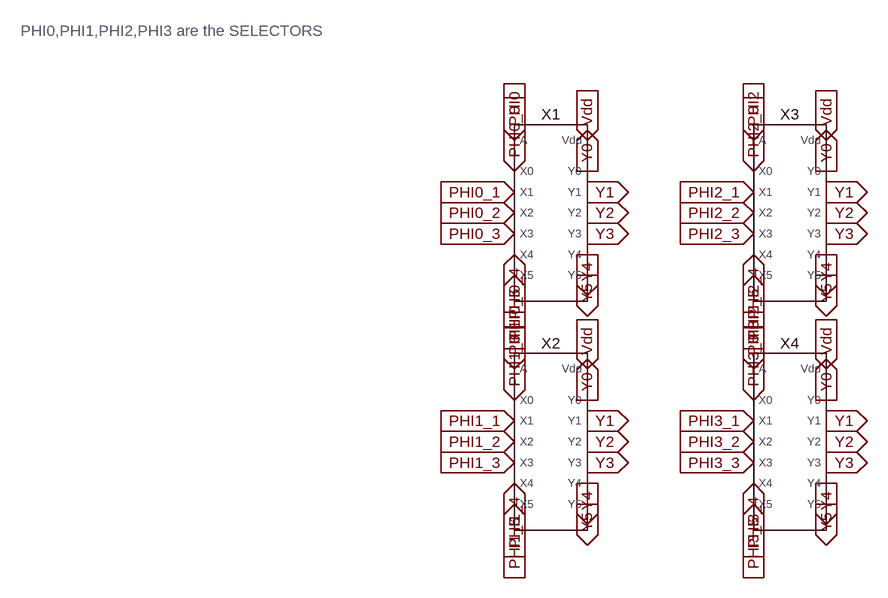
[diagram p0: schematic 24X6MUC.asc]
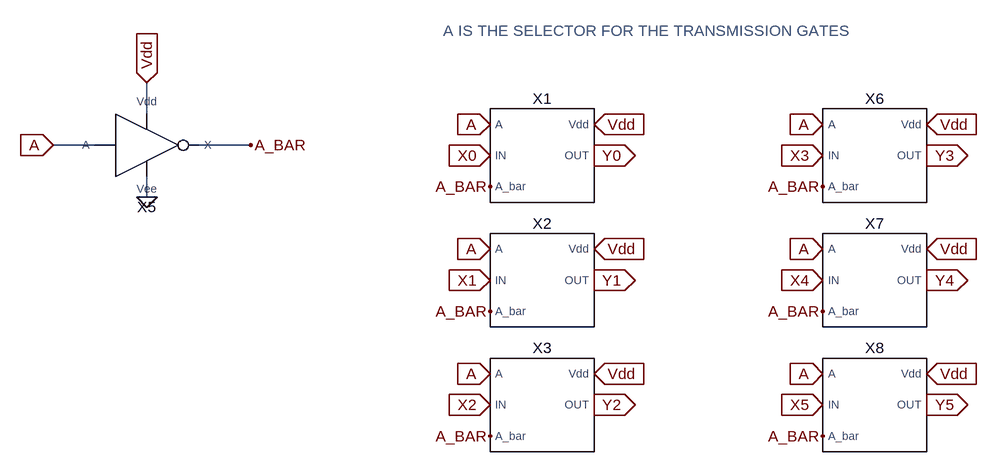
[diagram p1: sub-circuit 6x6tg.asc]
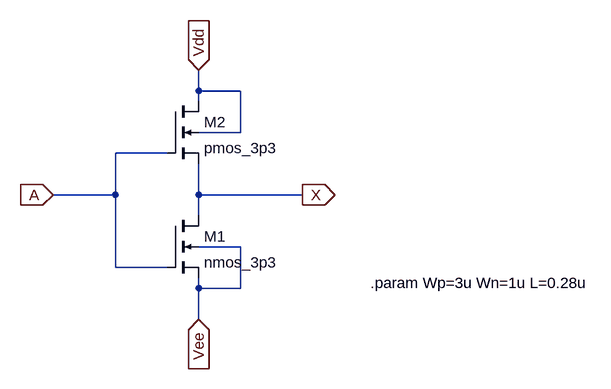
[diagram p2: sub-circuit invx1.asc]
24X6MUC.asc, the LTspice schematic file:
Version 4
SHEET 1 880 1068
FLAG -208 16 PHI0_0
IOPIN -208 16 In
FLAG -208 48 PHI0_1
IOPIN -208 48 In
FLAG -208 80 PHI0_2
IOPIN -208 80 In
FLAG -208 112 PHI0_3
IOPIN -208 112 In
FLAG -208 144 PHI0_4
IOPIN -208 144 In
FLAG -208 176 PHI0_5
IOPIN -208 176 In
FLAG -208 -32 PHI0
IOPIN -208 -32 In
FLAG -96 16 Y0
IOPIN -96 16 Out
FLAG -96 48 Y1
IOPIN -96 48 Out
FLAG -96 80 Y2
IOPIN -96 80 Out
FLAG -96 112 Y3
IOPIN -96 112 Out
FLAG -96 144 Y4
IOPIN -96 144 Out
FLAG -96 176 Y5
IOPIN -96 176 Out
FLAG -96 -32 Vdd
IOPIN -96 -32 In
FLAG -208 368 PHI1_0
IOPIN -208 368 In
FLAG -208 400 PHI1_1
IOPIN -208 400 In
FLAG -208 432 PHI1_2
IOPIN -208 432 In
FLAG -208 464 PHI1_3
IOPIN -208 464 In
FLAG -208 496 PHI1_4
IOPIN -208 496 In
FLAG -208 528 PHI1_5
IOPIN -208 528 In
FLAG -208 320 PHI1
IOPIN -208 320 In
FLAG -96 368 Y0
IOPIN -96 368 Out
FLAG -96 400 Y1
IOPIN -96 400 Out
FLAG -96 432 Y2
IOPIN -96 432 Out
FLAG -96 464 Y3
IOPIN -96 464 Out
FLAG -96 496 Y4
IOPIN -96 496 Out
FLAG -96 528 Y5
IOPIN -96 528 Out
FLAG -96 320 Vdd
IOPIN -96 320 In
FLAG 160 16 PHI2_0
IOPIN 160 16 In
FLAG 160 48 PHI2_1
IOPIN 160 48 In
FLAG 160 80 PHI2_2
IOPIN 160 80 In
FLAG 160 112 PHI2_3
IOPIN 160 112 In
FLAG 160 144 PHI2_4
IOPIN 160 144 In
FLAG 160 176 PHI2_5
IOPIN 160 176 In
FLAG 160 -32 PHI2
IOPIN 160 -32 In
FLAG 272 16 Y0
IOPIN 272 16 Out
FLAG 272 48 Y1
IOPIN 272 48 Out
FLAG 272 80 Y2
IOPIN 272 80 Out
FLAG 272 112 Y3
IOPIN 272 112 Out
FLAG 272 144 Y4
IOPIN 272 144 Out
FLAG 272 176 Y5
IOPIN 272 176 Out
FLAG 272 -32 Vdd
IOPIN 272 -32 In
FLAG 160 368 PHI3_0
IOPIN 160 368 In
FLAG 160 400 PHI3_1
IOPIN 160 400 In
FLAG 160 432 PHI3_2
IOPIN 160 432 In
FLAG 160 464 PHI3_3
IOPIN 160 464 In
FLAG 160 496 PHI3_4
IOPIN 160 496 In
FLAG 160 528 PHI3_5
IOPIN 160 528 In
FLAG 160 320 PHI3
IOPIN 160 320 In
FLAG 272 368 Y0
IOPIN 272 368 Out
FLAG 272 400 Y1
IOPIN 272 400 Out
FLAG 272 432 Y2
IOPIN 272 432 Out
FLAG 272 464 Y3
IOPIN 272 464 Out
FLAG 272 496 Y4
IOPIN 272 496 Out
FLAG 272 528 Y5
IOPIN 272 528 Out
FLAG 272 320 Vdd
IOPIN 272 320 In
SYMBOL 6X6TG -160 80 R0
SYMATTR InstName X1
SYMBOL 6X6TG -160 432 R0
SYMATTR InstName X2
SYMBOL 6X6TG 208 80 R0
SYMATTR InstName X3
SYMBOL 6X6TG 208 432 R0
SYMATTR InstName X4
TEXT -968 -200 Left 2 ;PHI0,PHI1,PHI2,PHI3 are the SELECTORS

6x6tg.asc, the sub-circuit schematic file:
Version 4
SHEET 1 880 684
WIRE -448 -64 -448 -112
WIRE -528 -16 -592 -16
WIRE -288 -16 -368 -16
WIRE -448 64 -448 32
FLAG 240 -48 Vdd
IOPIN 240 -48 In
FLAG 240 0 Y0
IOPIN 240 0 Out
FLAG 80 0 X0
IOPIN 80 0 In
FLAG 80 -48 A
IOPIN 80 -48 In
FLAG -592 -16 A
IOPIN -592 -16 In
FLAG -288 -16 A_BAR
FLAG 80 48 A_BAR
FLAG 240 144 Vdd
IOPIN 240 144 In
FLAG 240 192 Y1
IOPIN 240 192 Out
FLAG 80 192 X1
IOPIN 80 192 In
FLAG 80 144 A
IOPIN 80 144 In
FLAG 80 240 A_BAR
FLAG 240 336 Vdd
IOPIN 240 336 In
FLAG 240 384 Y2
IOPIN 240 384 Out
FLAG 80 384 X2
IOPIN 80 384 In
FLAG 80 336 A
IOPIN 80 336 In
FLAG 80 432 A_BAR
FLAG -448 64 0
FLAG -448 -112 Vdd
IOPIN -448 -112 In
FLAG 752 -48 Vdd
IOPIN 752 -48 In
FLAG 752 0 Y3
IOPIN 752 0 Out
FLAG 592 0 X3
IOPIN 592 0 In
FLAG 592 -48 A
IOPIN 592 -48 In
FLAG 592 48 A_BAR
FLAG 752 144 Vdd
IOPIN 752 144 In
FLAG 752 192 Y4
IOPIN 752 192 Out
FLAG 592 192 X4
IOPIN 592 192 In
FLAG 592 144 A
IOPIN 592 144 In
FLAG 592 240 A_BAR
FLAG 752 336 Vdd
IOPIN 752 336 In
FLAG 752 384 Y5
IOPIN 752 384 Out
FLAG 592 384 X5
IOPIN 592 384 In
FLAG 592 336 A
IOPIN 592 336 In
FLAG 592 432 A_BAR
SYMBOL TGATE 160 0 R0
SYMATTR InstName X1
SYMBOL INVx1 -448 -16 R0
SYMATTR InstName X5
SYMBOL TGATE 160 192 R0
SYMATTR InstName X2
SYMBOL TGATE 160 384 R0
SYMATTR InstName X3
SYMBOL TGATE 672 0 R0
SYMATTR InstName X6
SYMBOL TGATE 672 192 R0
SYMATTR InstName X7
SYMBOL TGATE 672 384 R0
SYMATTR InstName X8
TEXT 8 -192 Left 2 ;A IS THE SELECTOR FOR THE TRANSMISSION GATES

invx1.asc, the sub-circuit schematic file:
Version 4
SHEET 1 2776 836
WIRE 416 -16 416 -48
WIRE 480 -16 416 -16
WIRE 416 0 416 -16
WIRE 480 48 480 -16
WIRE 480 48 416 48
WIRE 368 80 288 80
WIRE 288 144 288 80
WIRE 288 144 192 144
WIRE 416 144 416 96
WIRE 576 144 416 144
WIRE 416 176 416 144
WIRE 480 224 416 224
WIRE 288 256 288 144
WIRE 368 256 288 256
WIRE 416 288 416 272
WIRE 480 288 480 224
WIRE 480 288 416 288
WIRE 416 336 416 288
FLAG 416 -48 Vdd
IOPIN 416 -48 In
FLAG 192 144 A
IOPIN 192 144 In
FLAG 576 144 X
IOPIN 576 144 Out
FLAG 416 336 Vee
IOPIN 416 336 In
SYMBOL nmos4 368 176 R0
SYMATTR InstName M1
SYMATTR Value nmos_3p3
SYMATTR Value2 l={L} w={Wn}
SYMBOL nmos4 368 0 R0
SYMATTR InstName M2
SYMATTR Value pmos_3p3
SYMATTR Value2 l={L} w={Wp}
TEXT 680 280 Left 2 !.param Wp=3u Wn=1u L=0.28u

The netlist it stands for:
* 24X6MUC.asc
XX1 PHI0 Vdd PHI0_0 PHI0_1 PHI0_2 PHI0_3 PHI0_4 PHI0_5 Y0 Y1 Y2 Y3 Y4 Y5 6x6tg
XX2 PHI1 Vdd PHI1_0 PHI1_1 PHI1_2 PHI1_3 PHI1_4 PHI1_5 Y0 Y1 Y2 Y3 Y4 Y5 6x6tg
XX3 PHI2 Vdd PHI2_0 PHI2_1 PHI2_2 PHI2_3 PHI2_4 PHI2_5 Y0 Y1 Y2 Y3 Y4 Y5 6x6tg
XX4 PHI3 Vdd PHI3_0 PHI3_1 PHI3_2 PHI3_3 PHI3_4 PHI3_5 Y0 Y1 Y2 Y3 Y4 Y5 6x6tg

* block symbol definitions
.subckt 6x6tg A Vdd X0 X1 X2 X3 X4 X5 Y0 Y1 Y2 Y3 Y4 Y5
XX1 A A_BAR X0 Vdd Y0 TGATE L=0.28u Wn=1u Wp=3u M=1  ; pins A A_bar IN Vdd OUT
XX5 A Vdd A_BAR 0 invx1
XX2 A A_BAR X1 Vdd Y1 TGATE L=0.28u Wn=1u Wp=3u M=1  ; pins A A_bar IN Vdd OUT
XX3 A A_BAR X2 Vdd Y2 TGATE L=0.28u Wn=1u Wp=3u M=1  ; pins A A_bar IN Vdd OUT
XX6 A A_BAR X3 Vdd Y3 TGATE L=0.28u Wn=1u Wp=3u M=1  ; pins A A_bar IN Vdd OUT
XX7 A A_BAR X4 Vdd Y4 TGATE L=0.28u Wn=1u Wp=3u M=1  ; pins A A_bar IN Vdd OUT
XX8 A A_BAR X5 Vdd Y5 TGATE L=0.28u Wn=1u Wp=3u M=1  ; pins A A_bar IN Vdd OUT
* A IS THE SELECTOR FOR THE TRANSMISSION GATES
.ends 6x6tg

.subckt invx1 A Vdd X Vee
M1 X A Vee Vee nmos_3p3 l={L} w={Wn}
M2 Vdd A X Vdd pmos_3p3 l={L} w={Wp}
.param Wp=3u Wn=1u L=0.28u
.ends invx1

.model NMOS NMOS
.model PMOS PMOS
.lib standard.mos
* PHI0,PHI1,PHI2,PHI3 are the SELECTORS
.backanno
.end